# EAGLE design T3DPC_v0.2 (EAGLE 8.0.0)

## Sheet 1 of 4
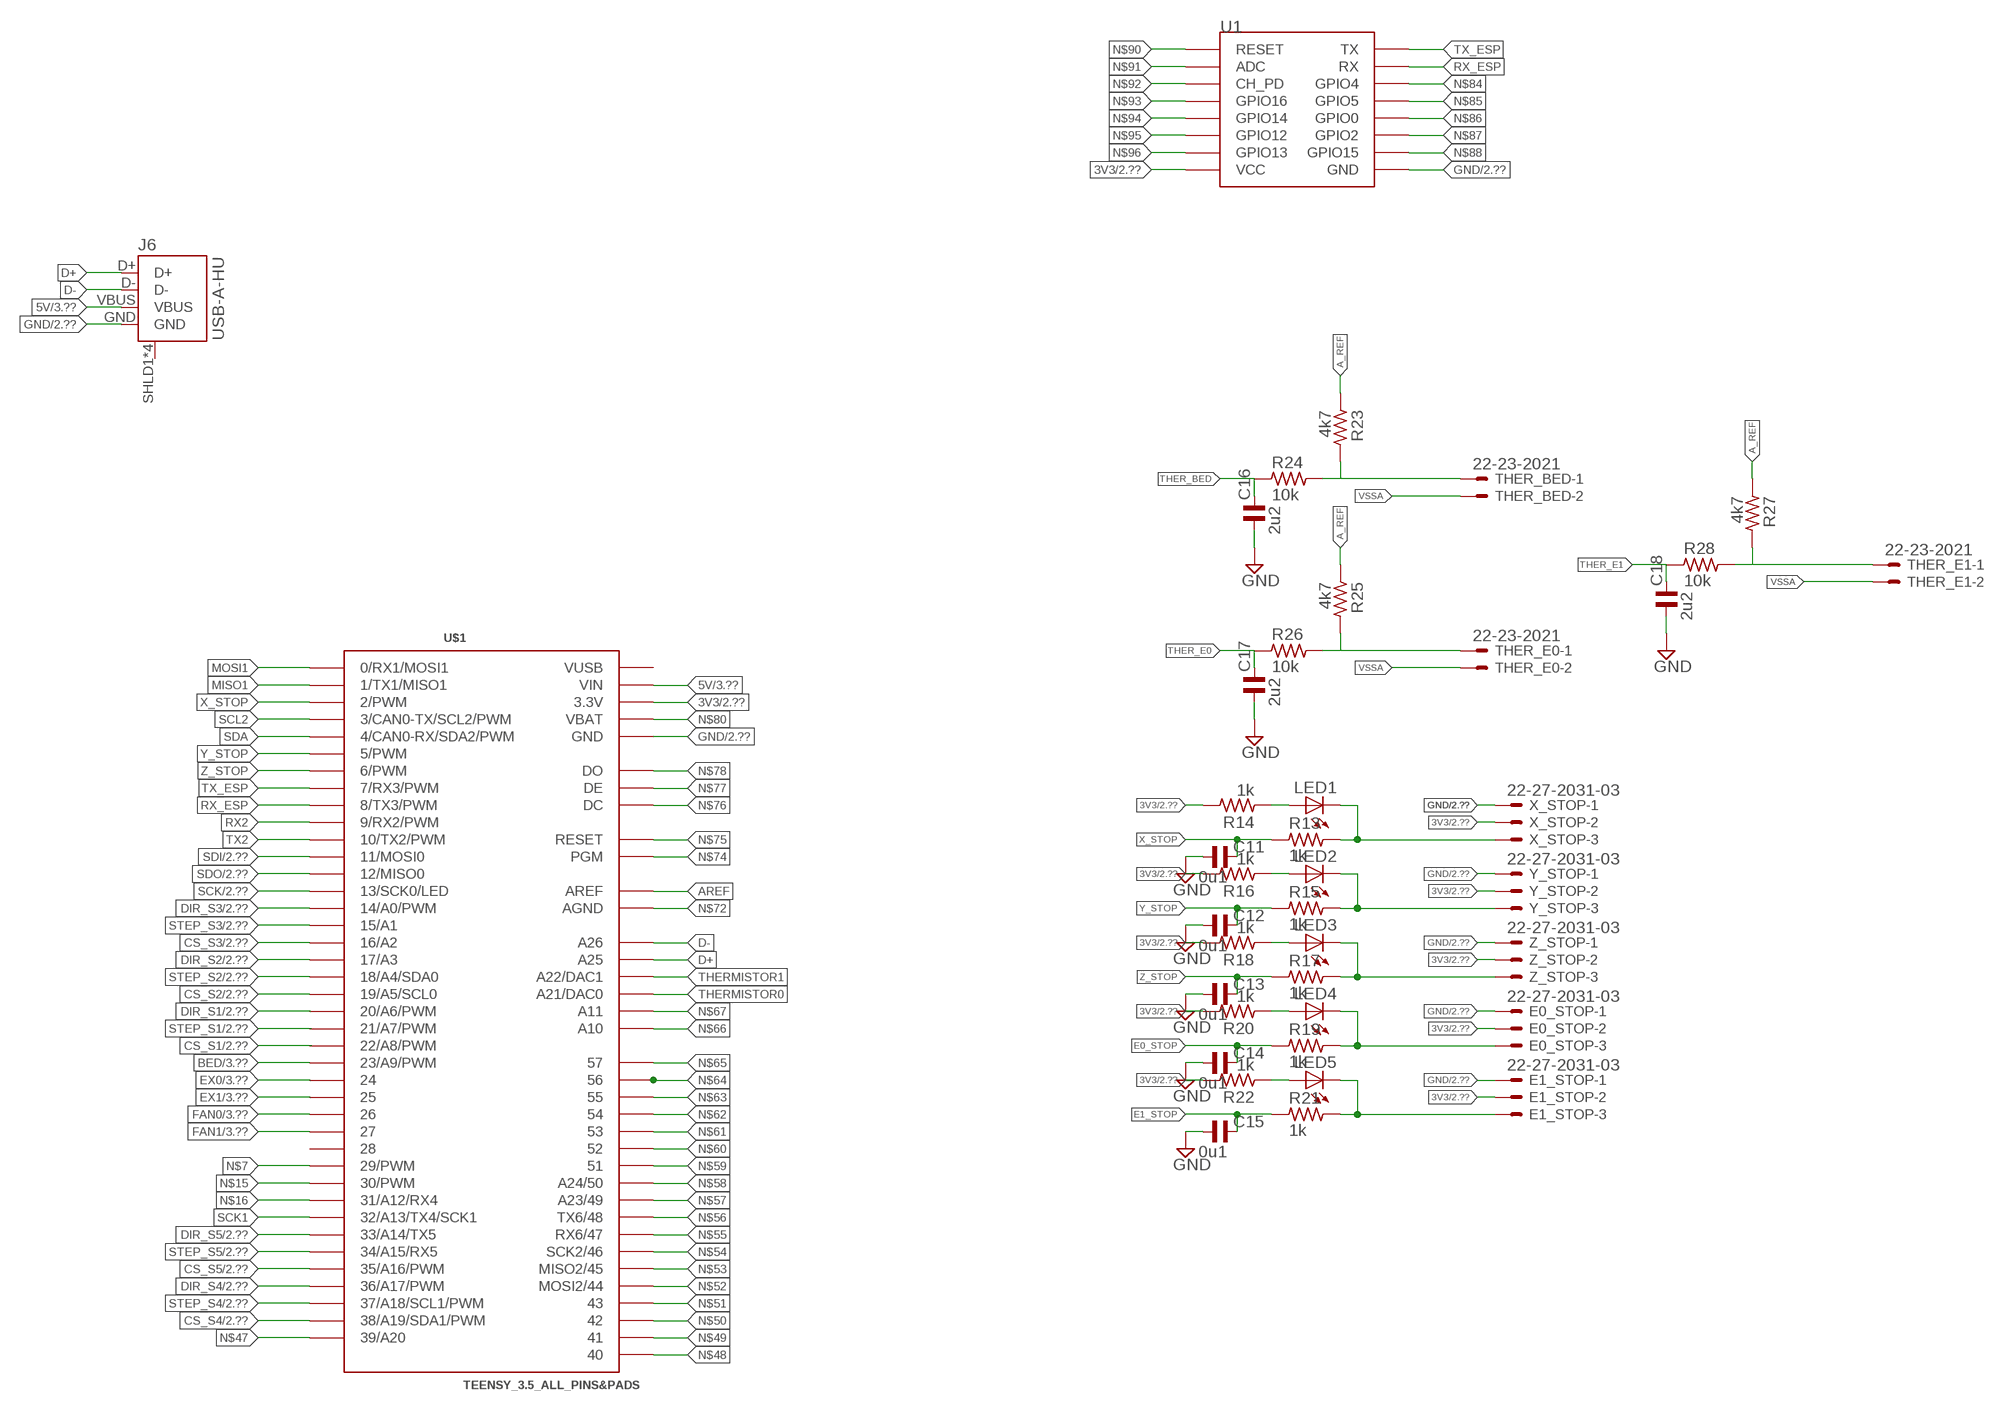
[diagram p0: schematic, sheet 1]

### Parts
C11  0u1  C_0805  [C0805]
C12  0u1  C_0805  [C0805]
C13  0u1  C_0805  [C0805]
C14  0u1  C_0805  [C0805]
C15  0u1  C_0805  [C0805]
C16  2u2  C_0805  [C0805]
C17  2u2  C_0805  [C0805]
C18  2u2  C_0805  [C0805]
E0_STOP  22-27-2031-03  [6410-03]
E1_STOP  22-27-2031-03  [6410-03]
J6  USB-A-HU  [USB-A-HU]
LED1  LEDCHIPLED_1206  [CHIPLED_1206]
LED2  LEDCHIPLED_1206  [CHIPLED_1206]
LED3  LEDCHIPLED_1206  [CHIPLED_1206]
LED4  LEDCHIPLED_1206  [CHIPLED_1206]
LED5  LEDCHIPLED_1206  [CHIPLED_1206]
R13  1k  R_0805  [R0805]
R14  1k  R_0805  [R0805]
R15  1k  R_0805  [R0805]
R16  1k  R_0805  [R0805]
R17  1k  R_0805  [R0805]
R18  1k  R_0805  [R0805]
R19  1k  R_0805  [R0805]
R20  1k  R_0805  [R0805]
R21  1k  R_0805  [R0805]
R22  1k  R_0805  [R0805]
R23  4k7  R_0805  [R0805]
R24  10k  R_0805  [R0805]
R25  4k7  R_0805  [R0805]
R26  10k  R_0805  [R0805]
R27  4k7  R_0805  [R0805]
R28  10k  R_0805  [R0805]
THER_BED  22-23-2021  [22-23-2021]
THER_E0  22-23-2021  [22-23-2021]
THER_E1  22-23-2021  [22-23-2021]
U1  ESP12SMD  [ESP12-SMD]
U$1  TEENSY_3.5_ALL_PINS&PADS  [TEENSY_3.5_ALL_PINS&PADS]
X_STOP  22-27-2031-03  [6410-03]
Y_STOP  22-27-2031-03  [6410-03]
Z_STOP  22-27-2031-03  [6410-03]

### Nets
3V3: E0_STOP.2 E1_STOP.2 R14.2 R16.2 R18.2 R20.2 R22.2 U1.VCC U$1.3.3V U$1.3.3V2(3.3V) U$1.3.3V3(3.3V) U$1.3.3V4(3.3V) X_STOP.2 Y_STOP.2 Z_STOP.2 ; also sheet 2,3
5V: J6.VBUS U$1.VIN ; also sheet 3,4
A_REF: R23.1 R25.1 R27.1
AREF: U$1.AREF
BED: U$1.23/A9(23/A9/PWM) ; also sheet 3
CS_S1: U$1.22/A8(22/A8/PWM) ; also sheet 2
CS_S2: U$1.19/A5(19/A5/SCL0) ; also sheet 2
CS_S3: U$1.16/A2 ; also sheet 2
CS_S4: U$1.38/A19(38/A19/SDA1/PWM) ; also sheet 2
CS_S5: U$1.35/A16(35/A16/PWM) ; also sheet 2
D+: J6.D+ U$1.A25
D-: J6.D- U$1.A26
DIR_S1: U$1.20/A6(20/A6/PWM) ; also sheet 2
DIR_S2: U$1.17/A3 ; also sheet 2
DIR_S3: U$1.14/A0(14/A0/PWM) ; also sheet 2
DIR_S4: U$1.36/A17(36/A17/PWM) ; also sheet 2
DIR_S5: U$1.33/A14(33/A14/TX5) ; also sheet 2
E0_STOP: C14.2 R19.1
E1_STOP: C15.2 R21.1
EX0: U$1.24 ; also sheet 3
EX1: U$1.25 ; also sheet 3
GND: C11.1 C12.1 C13.1 C14.1 C15.1 C16.1 C17.1 C18.1 E0_STOP.1 E1_STOP.1 J6.GND U1.GND U$1.GND U$1.GND1(GND) U$1.GND2(GND) U$1.GND3(GND) U$1.GND4(GND) U$1.GND5(GND) U$1.GND6(GND) X_STOP.1 Y_STOP.1 Z_STOP.1 ; also sheet 2,3,4
MISO1: U$1.1(1/TX1/MISO1)
MOSI1: U$1.0(0/RX1/MOSI1)
N$7: U$1.29(29/PWM)
N$10: LED1.A R14.1
N$13: LED2.A R16.1
N$14: LED3.A R18.1
N$15: U$1.30(30/PWM)
N$16: U$1.31/A12(31/A12/RX4)
N$17: LED4.A R20.1
N$18: LED5.A R22.1
N$19: R25.2 R26.2 THER_E0.1
N$20: R23.2 R24.2 THER_BED.1
N$22: R27.2 R28.2 THER_E1.1
N$47: U$1.39/A20
N$48: U$1.40
N$49: U$1.41
N$50: U$1.42
N$51: U$1.43
N$52: U$1.44(MOSI2/44)
N$53: U$1.45(MISO2/45)
N$54: U$1.46(SCK2/46)
N$55: U$1.47(RX6/47)
N$56: U$1.48(TX6/48)
N$57: U$1.49(A23/49)
N$58: U$1.50(A24/50)
N$59: U$1.51
N$60: U$1.52
N$61: U$1.53
N$62: U$1.54
N$63: U$1.55
N$64: U$1.56
N$65: U$1.57
N$66: U$1.A10
N$67: U$1.A11
N$72: U$1.AGND
N$74: U$1.PGM
N$75: U$1.RESET
N$76: U$1.DC
N$77: U$1.DE
N$78: U$1.DO
N$80: U$1.VBAT
N$84: U1.GPIO4
N$85: U1.GPIO5
N$86: U1.GPIO0
N$87: U1.GPIO2
N$88: U1.GPIO15
N$90: U1.RESET
N$91: U1.ADC
N$92: U1.CH_PD
N$93: U1.GPIO16
N$94: U1.GPIO14
N$95: U1.GPIO12
N$96: U1.GPIO13
RX2: U$1.9(9/RX2/PWM)
RX_ESP: U1.RXD0(RX) U$1.8(8/TX3/PWM)
SCK: U$1.13(13/SCK0/LED) ; also sheet 2
SCK1: U$1.32/A13(32/A13/TX4/SCK1)
SCL2: U$1.3(3/CAN0-TX/SCL2/PWM)
SDA: U$1.4(4/CAN0-RX/SDA2/PWM)
SDI: U$1.11(11/MOSI0) ; also sheet 2
SDO: U$1.12(12/MISO0) ; also sheet 2
STEP_S1: U$1.21/A7(21/A7/PWM) ; also sheet 2
STEP_S2: U$1.18/A4(18/A4/SDA0) ; also sheet 2
STEP_S3: U$1.15/A1 ; also sheet 2
STEP_S4: U$1.37/A18(37/A18/SCL1/PWM) ; also sheet 2
STEP_S5: U$1.34/A15(34/A15/RX5) ; also sheet 2
THER_BED: C16.2 R24.1
THER_E0: C17.2 R26.1
THER_E1: C18.2 R28.1
THERMISTOR0: U$1.A21(A21/DAC0)
THERMISTOR1: U$1.A22(A22/DAC1)
TX2: U$1.10(10/TX2/PWM)
TX_ESP: U1.TXD0(TX) U$1.7(7/RX3/PWM)
VSSA: THER_BED.2 THER_E0.2 THER_E1.2
X_STOP: C11.2 LED1.C LED2.C LED3.C LED4.C LED5.C R13.1 R13.2 R15.2 R17.2 R19.2 R21.2 U$1.2(2/PWM) X_STOP.3
Y_STOP: C12.2 R15.1 U$1.5(5/PWM)
Z_STOP: C13.2 R17.1 U$1.6(6/PWM)
Unconnected: E0_STOP.3 E1_STOP.3 J6.SHLD1(SHIELD) J6.SHLD2(SHIELD) J6.SHLD3(SHIELD) J6.SHLD4(SHIELD) U$1.26 U$1.27 U$1.28 Y_STOP.3 Z_STOP.3

## Sheet 2 of 4
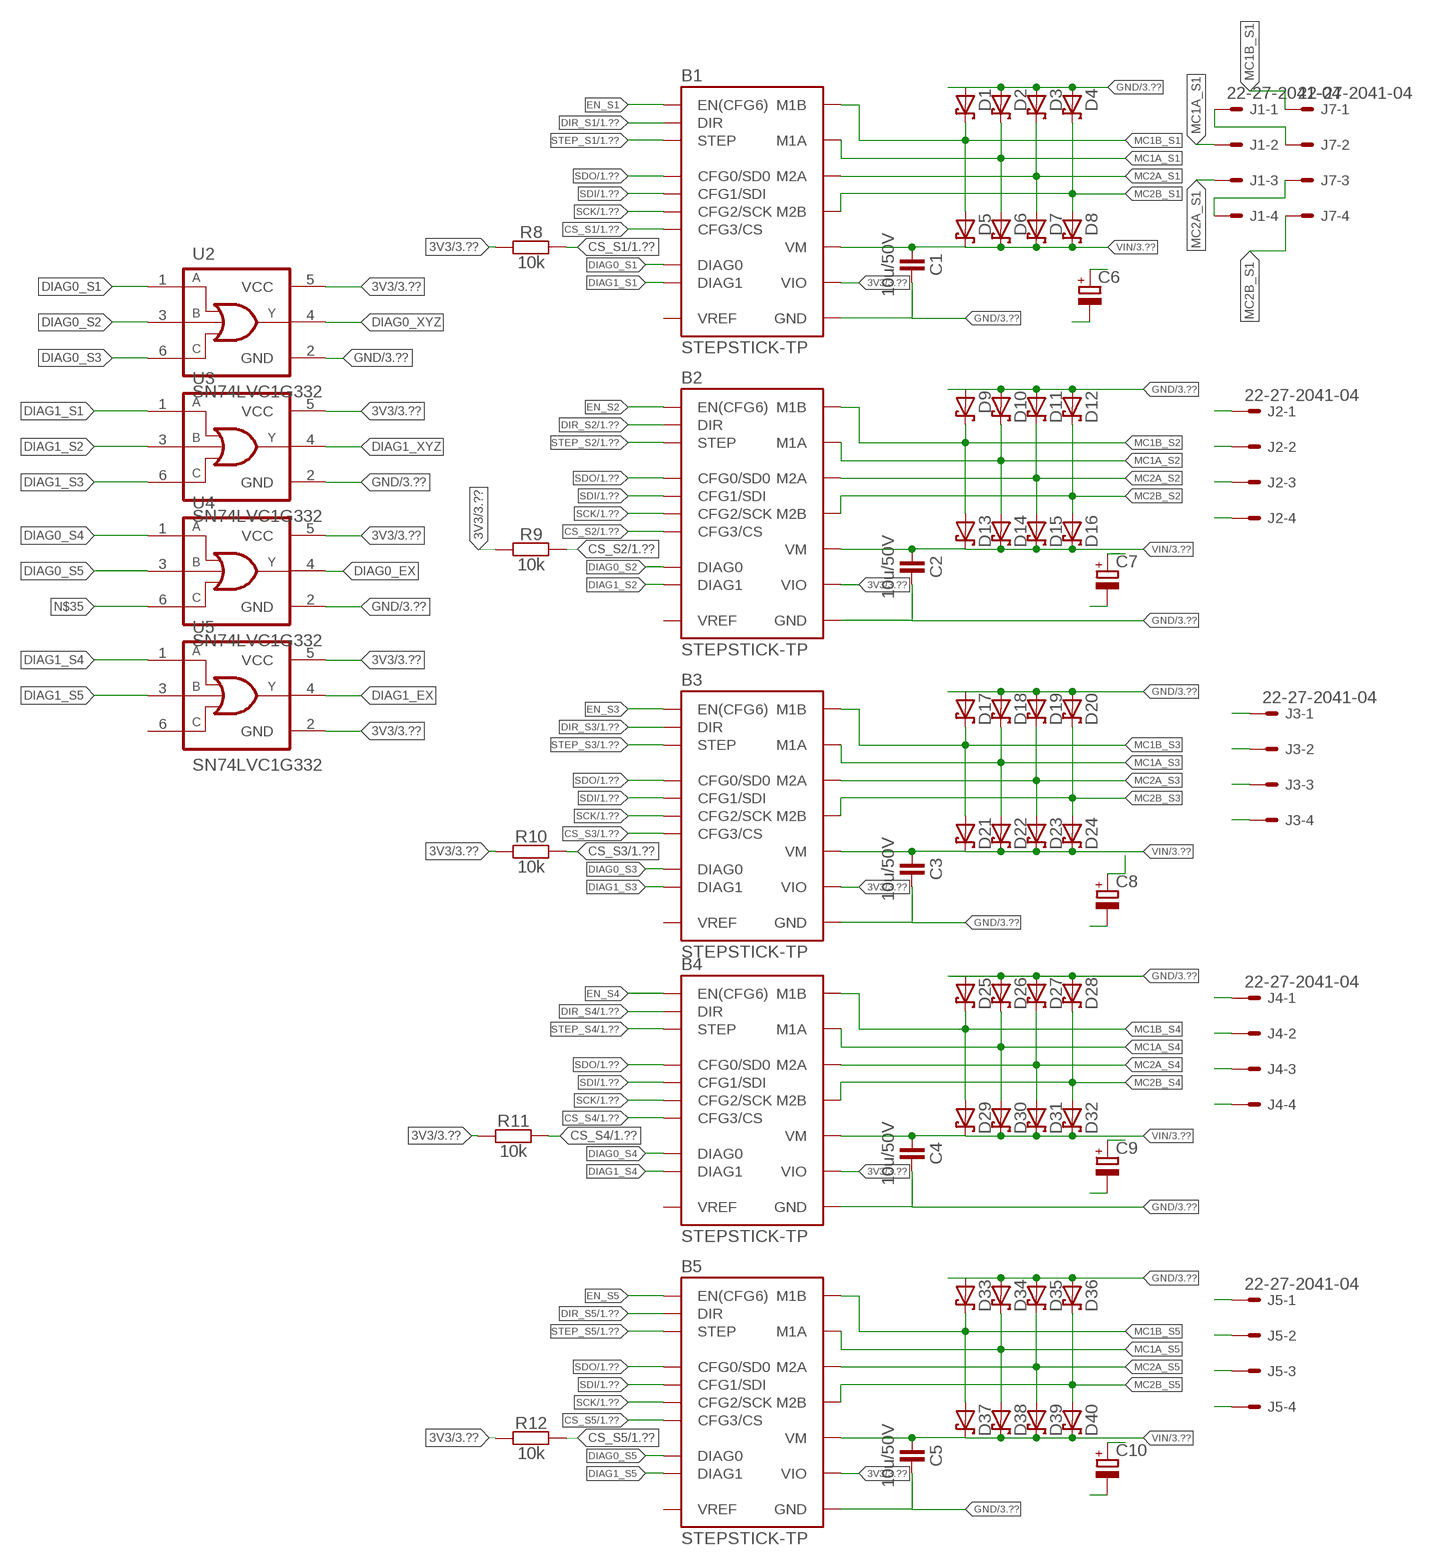
[diagram p1: schematic, sheet 2]

### Parts
B1  STEPSTICK-TP  [STEPSTICK_TP]
B2  STEPSTICK-TP  [STEPSTICK_TP]
B3  STEPSTICK-TP  [STEPSTICK_TP]
B4  STEPSTICK-TP  [STEPSTICK_TP]
B5  STEPSTICK-TP  [STEPSTICK_TP]
C1  10u/50V  CAPACITOR-1210  [C1210]
C2  10u/50V  CAPACITOR-1210  [C1210]
C3  10u/50V  CAPACITOR-1210  [C1210]
C4  10u/50V  CAPACITOR-1210  [C1210]
C5  10u/50V  CAPACITOR-1210  [C1210]
C6  CPOL-EU153CLV-0505  [153CLV-0505]
C7  CPOL-EU153CLV-0505  [153CLV-0505]
C8  CPOL-EU153CLV-0505  [153CLV-0505]
C9  CPOL-EU153CLV-0505  [153CLV-0505]
C10  CPOL-EU153CLV-0505  [153CLV-0505]
D1  D_SCHOTTKY-SMA  [SMA_DO214AC]
D2  D_SCHOTTKY-SMA  [SMA_DO214AC]
D3  D_SCHOTTKY-SMA  [SMA_DO214AC]
D4  D_SCHOTTKY-SMA  [SMA_DO214AC]
D5  D_SCHOTTKY-SMA  [SMA_DO214AC]
D6  D_SCHOTTKY-SMA  [SMA_DO214AC]
D7  D_SCHOTTKY-SMA  [SMA_DO214AC]
D8  D_SCHOTTKY-SMA  [SMA_DO214AC]
D9  D_SCHOTTKY-SMA  [SMA_DO214AC]
D10  D_SCHOTTKY-SMA  [SMA_DO214AC]
D11  D_SCHOTTKY-SMA  [SMA_DO214AC]
D12  D_SCHOTTKY-SMA  [SMA_DO214AC]
D13  D_SCHOTTKY-SMA  [SMA_DO214AC]
D14  D_SCHOTTKY-SMA  [SMA_DO214AC]
D15  D_SCHOTTKY-SMA  [SMA_DO214AC]
D16  D_SCHOTTKY-SMA  [SMA_DO214AC]
D17  D_SCHOTTKY-SMA  [SMA_DO214AC]
D18  D_SCHOTTKY-SMA  [SMA_DO214AC]
D19  D_SCHOTTKY-SMA  [SMA_DO214AC]
D20  D_SCHOTTKY-SMA  [SMA_DO214AC]
D21  D_SCHOTTKY-SMA  [SMA_DO214AC]
D22  D_SCHOTTKY-SMA  [SMA_DO214AC]
D23  D_SCHOTTKY-SMA  [SMA_DO214AC]
D24  D_SCHOTTKY-SMA  [SMA_DO214AC]
D25  D_SCHOTTKY-SMA  [SMA_DO214AC]
D26  D_SCHOTTKY-SMA  [SMA_DO214AC]
D27  D_SCHOTTKY-SMA  [SMA_DO214AC]
D28  D_SCHOTTKY-SMA  [SMA_DO214AC]
D29  D_SCHOTTKY-SMA  [SMA_DO214AC]
D30  D_SCHOTTKY-SMA  [SMA_DO214AC]
D31  D_SCHOTTKY-SMA  [SMA_DO214AC]
D32  D_SCHOTTKY-SMA  [SMA_DO214AC]
D33  D_SCHOTTKY-SMA  [SMA_DO214AC]
D34  D_SCHOTTKY-SMA  [SMA_DO214AC]
D35  D_SCHOTTKY-SMA  [SMA_DO214AC]
D36  D_SCHOTTKY-SMA  [SMA_DO214AC]
D37  D_SCHOTTKY-SMA  [SMA_DO214AC]
D38  D_SCHOTTKY-SMA  [SMA_DO214AC]
D39  D_SCHOTTKY-SMA  [SMA_DO214AC]
D40  D_SCHOTTKY-SMA  [SMA_DO214AC]
J1  22-27-2041-04  [6410-04]
J2  22-27-2041-04  [6410-04]
J3  22-27-2041-04  [6410-04]
J4  22-27-2041-04  [6410-04]
J5  22-27-2041-04  [6410-04]
J7  22-27-2041-04  [6410-04]
R8  10k  RESISTOR-0805  [C0805]
R9  10k  RESISTOR-0805  [C0805]
R10  10k  RESISTOR-0805  [C0805]
R11  10k  RESISTOR-0805  [C0805]
R12  10k  RESISTOR-0805  [C0805]
U2  SN74LVC1G332  [SC70-6]
U3  SN74LVC1G332  [SC70-6]
U4  SN74LVC1G332  [SC70-6]
U5  SN74LVC1G332  [SC70-6]

### Nets
3V3: B1.VIO B2.VIO B3.VIO B4.VIO B5.VIO R8.1 R9.1 R10.1 R11.1 R12.1 U2.5(VCC) U3.5(VCC) U4.5(VCC) U5.2(GND) U5.5(VCC) ; also sheet 1,3
CS_S1: B1.CFG3(CFG3/CS) R8.2 ; also sheet 1
CS_S2: B2.CFG3(CFG3/CS) R9.2 ; also sheet 1
CS_S3: B3.CFG3(CFG3/CS) R10.2 ; also sheet 1
CS_S4: B4.CFG3(CFG3/CS) R11.2 ; also sheet 1
CS_S5: B5.CFG3(CFG3/CS) R12.2 ; also sheet 1
DIAG0_EX: U4.4(Y)
DIAG0_S1: B1.DIAG0 U2.1(A)
DIAG0_S2: B2.DIAG0 U2.3(B)
DIAG0_S3: B3.DIAG0 U2.6(C)
DIAG0_S4: B4.DIAG0 U4.1(A)
DIAG0_S5: B5.DIAG0 U4.3(B)
DIAG0_XYZ: U2.4(Y)
DIAG1_EX: U5.4(Y)
DIAG1_S1: B1.DIAG1 U3.1(A)
DIAG1_S2: B2.DIAG1 U3.3(B)
DIAG1_S3: B3.DIAG1 U3.6(C)
DIAG1_S4: B4.DIAG1 U5.1(A)
DIAG1_S5: B5.DIAG1 U5.3(B)
DIAG1_XYZ: U3.4(Y)
DIR_S1: B1.DIR ; also sheet 1
DIR_S2: B2.DIR ; also sheet 1
DIR_S3: B3.DIR ; also sheet 1
DIR_S4: B4.DIR ; also sheet 1
DIR_S5: B5.DIR ; also sheet 1
EN_S1: B1.EN(EN(CFG6))
EN_S2: B2.EN(EN(CFG6))
EN_S3: B3.EN(EN(CFG6))
EN_S4: B4.EN(EN(CFG6))
EN_S5: B5.EN(EN(CFG6))
GND: B1.GND@1(GND) B1.GND@2(GND) B2.GND@1(GND) B2.GND@2(GND) B3.GND@1(GND) B3.GND@2(GND) B4.GND@1(GND) B4.GND@2(GND) B5.GND@1(GND) B5.GND@2(GND) C1.2 C2.2 C3.2 C4.2 C5.2 C6.- C7.- C8.- C9.- C10.- D1.A D2.A D3.A D4.A D9.A D10.A D11.A D12.A D17.A D18.A D19.A D20.A D25.A D26.A D27.A D28.A D33.A D34.A D35.A D36.A U2.2(GND) U3.2(GND) U4.2(GND) ; also sheet 1,3,4
MC1A_S1: B1.M1A D2.C D6.A J1.2
MC1A_S2: B2.M1A D10.C D14.A J2.2
MC1A_S3: B3.M1A D18.C D22.A J3.2
MC1A_S4: B4.M1A D26.C D30.A J4.2
MC1A_S5: B5.M1A D34.C D38.A J5.2
MC1B_S1: B1.M1B D1.C D5.A J7.1
MC1B_S2: B2.M1B D9.C D13.A J2.1
MC1B_S3: B3.M1B D17.C D21.A J3.1
MC1B_S4: B4.M1B D25.C D29.A J4.1
MC1B_S5: B5.M1B D33.C D37.A J5.1
MC2A_S1: B1.M2A D3.C D7.A J1.3
MC2A_S2: B2.M2A D11.C D15.A J2.3
MC2A_S3: B3.M2A D19.C D23.A J3.3
MC2A_S4: B4.M2A D27.C D31.A J4.3
MC2A_S5: B5.M2A D35.C D39.A J5.3
MC2B_S1: B1.M2B D4.C D8.A J7.4
MC2B_S2: B2.M2B D12.C D16.A J2.4
MC2B_S3: B3.M2B D20.C D24.A J3.4
MC2B_S4: B4.M2B D28.C D32.A J4.4
MC2B_S5: B5.M2B D36.C D40.A J5.4
N$11: J1.4 J7.3
N$12: J1.1 J7.2
N$35: U4.6(C)
SCK: B1.CFG2(CFG2/SCK) B2.CFG2(CFG2/SCK) B3.CFG2(CFG2/SCK) B4.CFG2(CFG2/SCK) B5.CFG2(CFG2/SCK) ; also sheet 1
SDI: B1.CFG1(CFG1/SDI) B2.CFG1(CFG1/SDI) B3.CFG1(CFG1/SDI) B4.CFG1(CFG1/SDI) B5.CFG1(CFG1/SDI) ; also sheet 1
SDO: B1.NC/CFG0(CFG0/SD0) B2.NC/CFG0(CFG0/SD0) B3.NC/CFG0(CFG0/SD0) B4.NC/CFG0(CFG0/SD0) B5.NC/CFG0(CFG0/SD0) ; also sheet 1
STEP_S1: B1.STEP ; also sheet 1
STEP_S2: B2.STEP ; also sheet 1
STEP_S3: B3.STEP ; also sheet 1
STEP_S4: B4.STEP ; also sheet 1
STEP_S5: B5.STEP ; also sheet 1
VIN: B1.VM B2.VM B3.VM B4.VM B5.VM C1.1 C2.1 C3.1 C4.1 C5.1 C6.+ C7.+ C8.+ C9.+ C10.+ D5.C D6.C D7.C D8.C D13.C D14.C D15.C D16.C D21.C D22.C D23.C D24.C D29.C D30.C D31.C D32.C D37.C D38.C D39.C D40.C ; also sheet 3,4
Unconnected: B1.VREF B2.VREF B3.VREF B4.VREF B5.VREF U5.6(C)

## Sheet 3 of 4
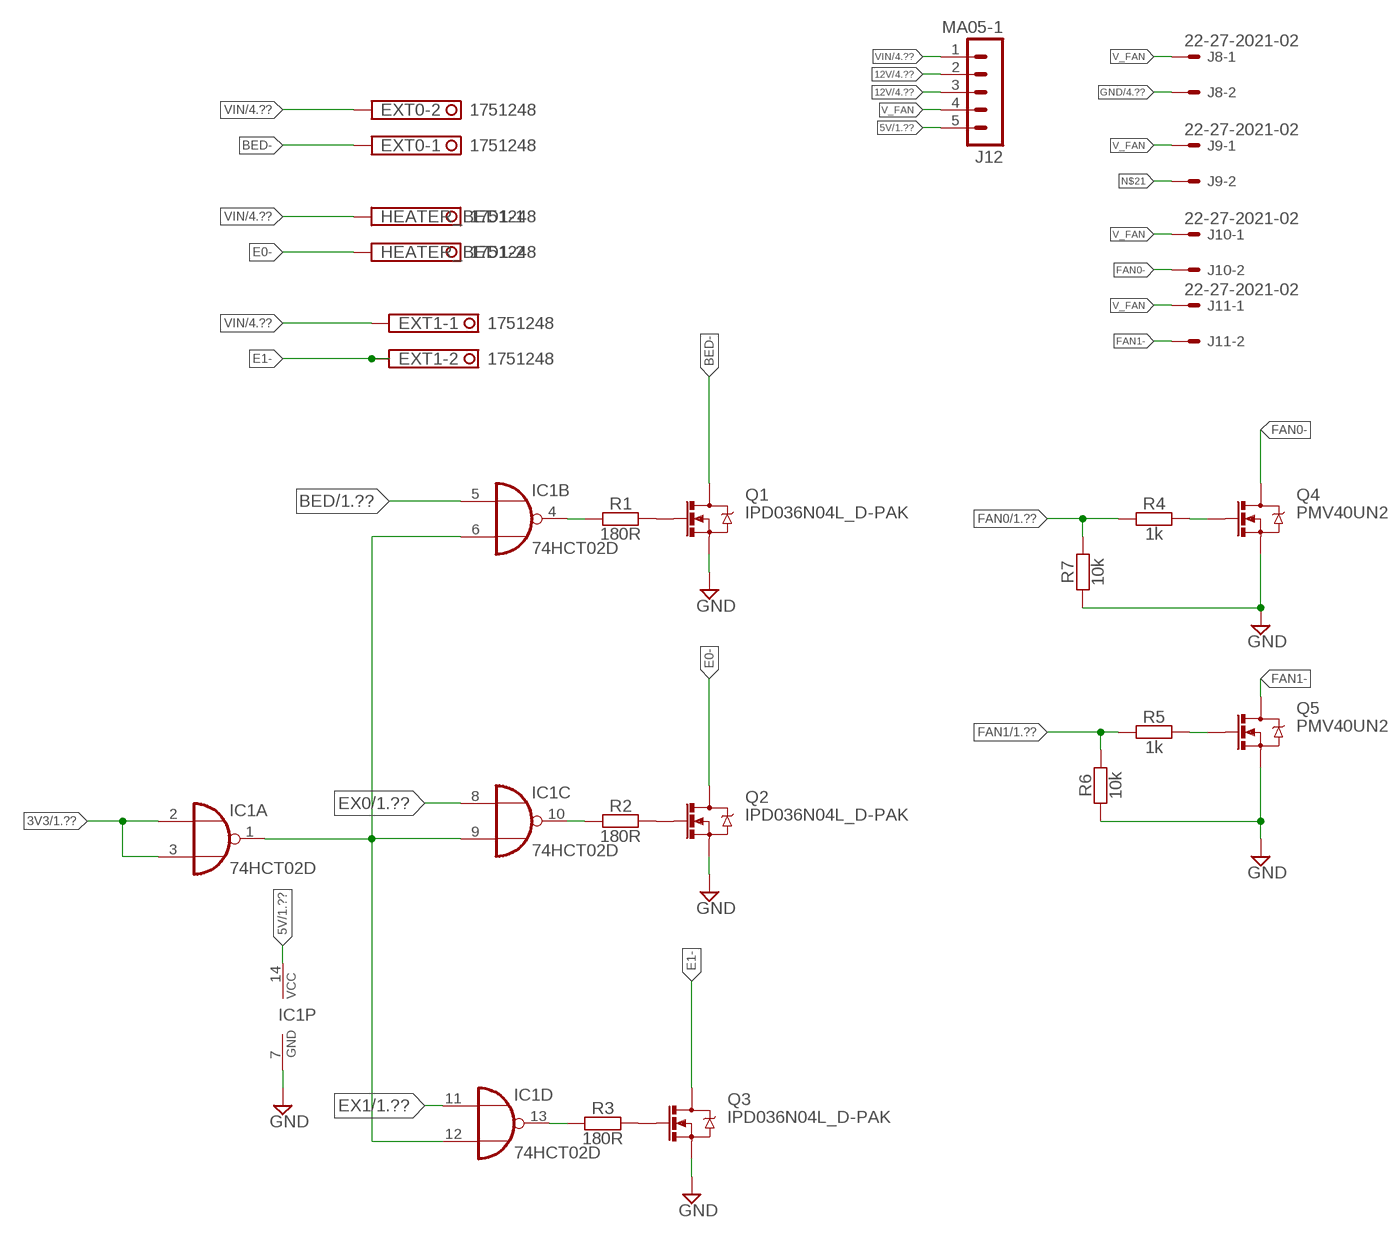
[diagram p2: schematic, sheet 3]

### Parts
EXT0  1751248  [1751248]
EXT1  1751248  [1751248]
HEATER_BED1  1751248  [1751248]
IC1  74HCT02D  [SO14]
J8  22-27-2021-02  [6410-02]
J9  22-27-2021-02  [6410-02]
J10  22-27-2021-02  [6410-02]
J11  22-27-2021-02  [6410-02]
J12  MA05-1  [MA05-1]
Q1  IPD036N04L_D-PAK  [D-PAK_TO252AA]
Q2  IPD036N04L_D-PAK  [D-PAK_TO252AA]
Q3  IPD036N04L_D-PAK  [D-PAK_TO252AA]
Q4  PMV40UN2  [SOT23-3]
Q5  PMV40UN2  [SOT23-3]
R1  180R  RESISTOR-0805  [C0805]
R2  180R  RESISTOR-0805  [C0805]
R3  180R  RESISTOR-0805  [C0805]
R4  1k  RESISTOR-0805  [C0805]
R5  1k  RESISTOR-0805  [C0805]
R6  10k  RESISTOR-0805  [C0805]
R7  10k  RESISTOR-0805  [C0805]

### Nets
3V3: IC1.2(A:I0) IC1.3(A:I1) ; also sheet 1,2
5V: IC1.14(P:VCC) J12.5 ; also sheet 1,4
12V: J12.2 J12.3 ; also sheet 4
BED: IC1.5(B:I0) ; also sheet 1
BED-: EXT0.1 Q1.2(D)
E0-: HEATER_BED1.2 Q2.2(D)
E1-: EXT1.2 Q3.2(D)
EX0: IC1.8(C:I0) ; also sheet 1
EX1: IC1.11(D:I0) ; also sheet 1
FAN0: R4.1 R7.2 ; also sheet 1
FAN0-: J10.2 Q4.3(D)
FAN1: R5.1 R6.2 ; also sheet 1
FAN1-: J11.2 Q5.3(D)
GND: IC1.7(P:GND) J8.2 Q1.3(S) Q2.3(S) Q3.3(S) Q4.2(S) Q5.2(S) R6.1 R7.1 ; also sheet 1,2,4
N$1: Q1.1(G) R1.2
N$2: Q2.1(G) R2.2
N$3: Q3.1(G) R3.2
N$4: IC1.4(B:O) R1.1
N$5: IC1.10(C:O) R2.1
N$6: IC1.13(D:O) R3.1
N$8: IC1.1(A:O) IC1.6(B:I1) IC1.9(C:I1) IC1.12(D:I1)
N$9: Q4.1(G) R4.2
N$21: J9.2
N$89: Q5.1(G) R5.2
V_FAN: J8.1 J9.1 J10.1 J11.1 J12.4
VIN: EXT0.2 EXT1.1 HEATER_BED1.1 J12.1 ; also sheet 2,4

## Sheet 4 of 4: Power
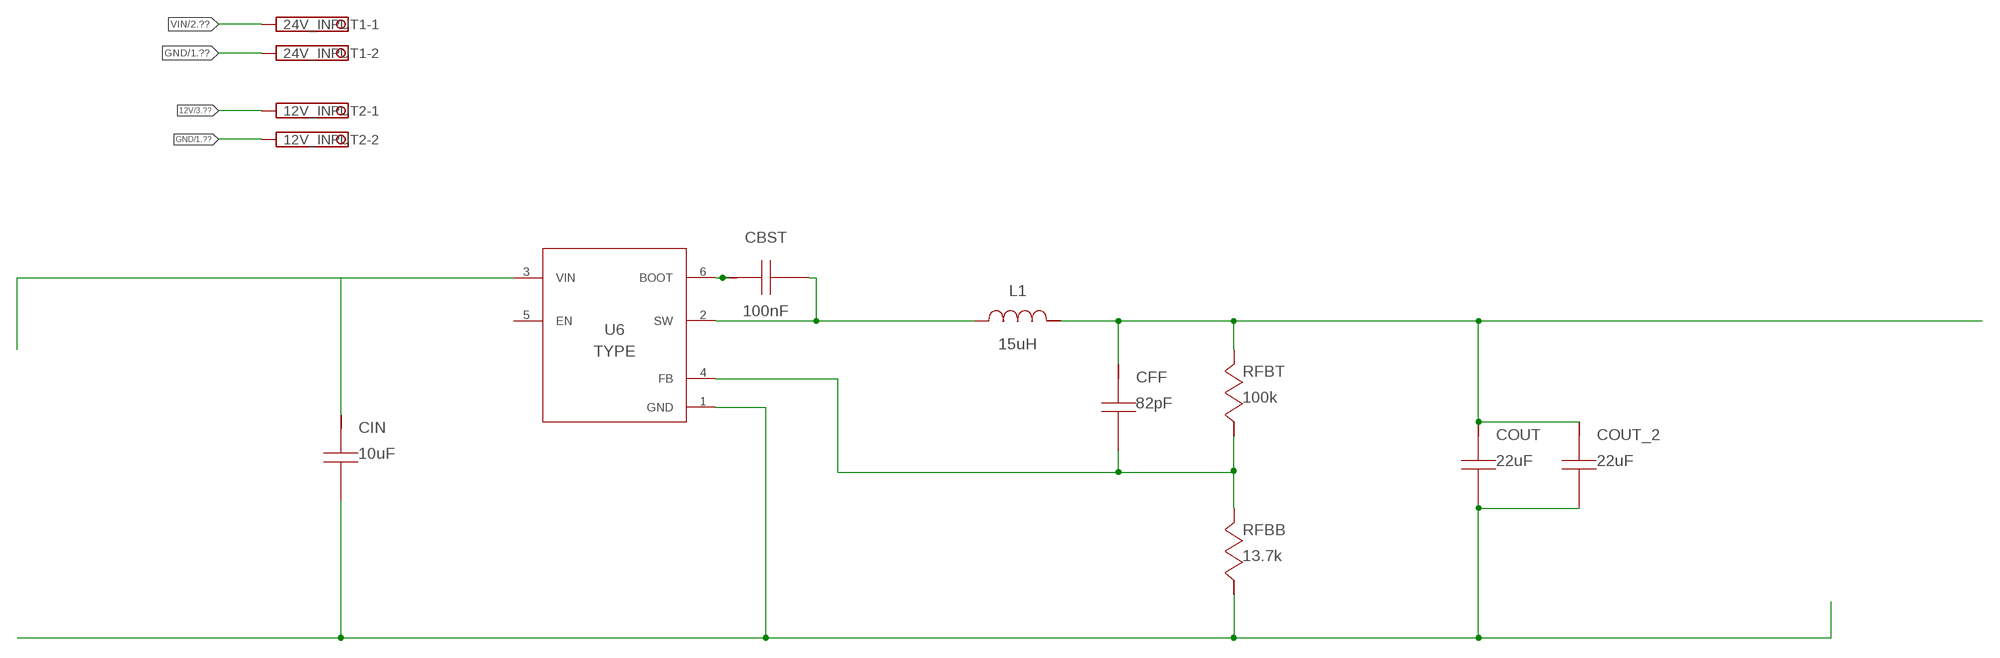
[diagram p3: schematic, sheet 4]

### Parts
12V_INPUT2  1751248  [1751248]
24V_INPUT1  1751248  [1751248]
CBST  100nF  C0805C104K5RACTU  [0805]
CFF  82pF  CC0805JRNPO9BN820  [0805]
CIN  10uF  C3216X5R1H106K160AB  [1206_180]
COUT  22uF  C4532X5R1E226M  [1812]
COUT_2  22uF  C4532X5R1E226M  [1812]
L1  15uH  VLP8040T-150M  [VLP8040]
RFBB  13.7k  ERJ-6ENF1372V  [0805]
RFBT  100k  ERJ-6ENF1003V  [0805]
U6  Value  TPS54202DDCR  [DDC0006A_N]

### Nets
1: CBST.1 U6.6(BOOT)
2: CFF.2 RFBB.1 RFBT.2 U6.4(FB)
3: CBST.2 L1.1 U6.2(SW)
5V: CFF.1 COUT.1 COUT_2.1 L1.2 RFBT.1 ; also sheet 1,3
12V: 12V_INPUT2.1 ; also sheet 3
GND: 12V_INPUT2.2 24V_INPUT1.2 CIN.2 COUT.2 COUT_2.2 RFBB.2 U6.1(GND) ; also sheet 1,2,3
VIN: 24V_INPUT1.1 CIN.1 U6.3(VIN) ; also sheet 2,3
Unconnected: U6.5(EN)

## Power pins joined to a net without a drawn wire
VUSB: U$1.VUSB

## Library data of the parts
12V_INPUT2 24V_INPUT1 EXT0 EXT1 HEATER_BED1 = con-phoenix-350:1751248: MKDS 1/ 2-3,5 Printklemme Nennstrom: 10 A Bemessungsspannung: 160 V Raster: 3,5 mm Polzahl: 2 Montageart: Löten Anschlussart: Schraubanschluss Anschlussrichtung vom Leiter zur Platine: 0° Source: http://eshop.phoenixcontact.com .. 1751248.pdf; OC_FARNELL: unknown; OC_NEWARK: unknown
B1-B5 = we-board:STEPSTICK: SilentStepStick - Trinamic TMC2100/TMC2130 Stepper Motor Driver TMC2100 - CFG pins for configuration TMC2130 - SPI for configuration Pin CFG0/SDO only available on TMC2130 SilentStepStick.
C1-C5 = we-rcl:CAPACITOR: Capacitors ...2.2uF @ 6.3V -> 0402 ...4.7uF @ 6.3V -> 0603 ...10uF @ 16V -> 0805 ...22uF @ 25V -> 1206
C6-C10 = rcl:CPOL-EU: POLARIZED CAPACITOR, European symbol
C11-C18 = rc-master-smd:C_: NON-POLARIZED CAP
CBST = AcceleratedDesigns_Lib:C0805C104K5RACTU; CAP: 1.0E7; ESR: 0.064; IRMS: 1.64; MANUFACTURER_NAME: Kemet; MANUFACTURER_PART_NUMBER: C0805C104K5RACTU; VDC: 50.0; VENDOR: Kemet
CFF = AcceleratedDesigns_Lib:CC0805JRNPO9BN820; CAP: 8.2E11; DATASHEETURL: httpwww.yageo.comdocumentsrecentUPY%2DGP%5FNP0%5F16V%2Dto%2D50V%5F10.pdf; ESR: 0.0; IRMS: 0.0; MANUFACTURER_NAME: Yageo America; MANUFACTURER_PART_NUMBER: CC0805JRNPO9BN820; VDC: 50.0; VENDOR: Yageo America
CIN = AcceleratedDesigns_Lib:C3216X5R1H106K160AB; CAP: 1.0E5; DATASHEETURL: httpsproduct.tdk.comensearchcapacitorceramicmlccinfo?part%5Fno%3DC3216X5R1H106K160AB; ESR: 0.002229; IRMS: 4.85932; MANUFACTURER_NAME: TDK; MANUFACTURER_PART_NUMBER: C3216X5R1H106K160AB; VDC: 50.0; VENDOR: TDK
COUT COUT_2 = AcceleratedDesigns_Lib:C4532X5R1E226M; CAP: 2.2E5; DATASHEETURL: httpwww.tdk.co.jptefe02e4855%5Fc.pdf; ESR: 0.002197; IRMS: 0.0; MANUFACTURER_NAME: TDK; MANUFACTURER_PART_NUMBER: C4532X5R1E226M; VDC: 25.0; VENDOR: TDK
D1-D40 = we-rcl:D_SCHOTTKY: Schottky Diodes
E0_STOP E1_STOP X_STOP Y_STOP Z_STOP = con-molex:22-?-03: CONNECTOR wire to board 2.54 mm (.1 inch) pitch header; OC_FARNELL: unknown; OC_NEWARK: unknown
IC1 = 74xx-eu:74*02: Quad 2-input NOR gate
J1-J5 J7 = con-molex:22-?-04: CONNECTOR wire to board 2.54 mm (.1 inch) pitch header; OC_FARNELL: unknown; OC_NEWARK: unknown
J6 = we-con:USB: USB Connectors
J8-J11 = con-molex:22-?-02: CONNECTOR wire to board 2.54 mm (.1 inch) pitch header; OC_FARNELL: unknown; OC_NEWARK: unknown
J12 = we-con:MA05-1: Pin Header
L1 = AcceleratedDesigns_Lib:VLP8040T-150M; DATASHEETURL: httpwww.tdk.co.jptjfx01j531_vlp.pdf; DCR: 0.058; DESCRIPTION: Unknown; IDC: 2.6; L: 1.5E5; MANUFACTURER: TDK; MANUFACTURER_NAME: TDK; MANUFACTURER_PART_NUMBER: VLP8040T150M; PACKAGE_DESIGNATOR: VLP8040; VENDOR: TDK
LED1-LED5 = led:LED: LED OSRAM: - CHIPLED LG R971, LG N971, LY N971, LG Q971, LY Q971, LO R971, LY R971 LH N974, LH R974 LS Q976, LO Q976, LY Q976 LO Q996 - Hyper CHIPLED LW Q18S LB Q993, LB Q99A, LB R99A - SideLED LS A670, LO A670, LY A670, LG A670, LP A670 LB A673, LV A673, LT A673, LW A673 LH A674 LY A675 LS A676, LA A676, LO A676, LY A676, LW A676 LS A679, LY A679, LG A679 - Hyper Micro SIDELED® LS Y876, LA Y876, LO Y876, LY Y876 LT Y87S - SmartLED LW L88C, LW L88S LB L89C, LB L89S, LG L890 LS L89K, LO L89K, LY L89K LS L896, LA L896, LO L896, LY L896 - TOPLED LS T670, LO T670, LY T670, LG T670, LP T670 LSG T670, LSP T670, LSY T670, LOP T670, LYG T670 LG T671, LOG T671, LSG T671 LB T673, LV T673, LT T673, LW T673 LH T674 LS T676, LA T676, LO T676, LY T676, LB T676, LH T676, LSB T676, LW T676 LB T67C, LV T67C, LT T67C, LS T67K, LO T67K, LY T67K, LW E67C LS E67B, LA E67B, LO E67B, LY E67B, LB E67C, LV E67C, LT E67C LW T67C LS T679, LY T679, LG T679 LS T770, LO T770, LY T770, LG T770, LP T770 LB T773, LV T773, LT T773, LW T773 LH T774 LS E675, LA E675, LY E675, LS T675 LS T776, LA T776, LO T776, LY T776, LB T776 LHGB T686 LT T68C, LB T68C - Hyper Mini TOPLED® LB M676 - Mini TOPLED Santana® LG M470 LS M47K, LO M47K, LY M47K Source: http://www.osram.convergy.de LUXEON: - LUMILED® LXK2-PW12-R00, LXK2-PW12-S00, LXK2-PW14-U00, LXK2-PW14-V00 LXK2-PM12-R00, LXK2-PM12-S00, LXK2-PM14-U00 LXK2-PE12-Q00, LXK2-PE12-R00, LXK2-PE12-S00, LXK2-PE14-T00, LXK2-PE14-U00 LXK2-PB12-K00, LXK2-PB12-L00, LXK2-PB12-M00, LXK2-PB14-N00, LXK2-PB14-P00, LXK2-PB14-Q00 LXK2-PR12-L00, LXK2-PR12-M00, LXK2-PR14-Q00, LXK2-PR14-R00 LXK2-PD12-Q00, LXK2-PD12-R00, LXK2-PD12-S00 LXK2-PH12-R00, LXK2-PH12-S00 LXK2-PL12-P00, LXK2-PL12-Q00, LXK2-PL12-R00 Source: www.luxeon.com KINGBRIGHT: KA-3528ASYC Source: www.kingbright.com
Q1-Q3 = infineon:IPD036N04L: Generic N-channel mosfet
Q4 Q5 = nxp:PMV40UN2
R1-R12 = we-rcl:RESISTOR: Resistors all kinds in 0402 and 0603
R13-R28 = rc-master-smd:R_: RESISTOR
RFBB = AcceleratedDesigns_Lib:ERJ-6ENF1372V; MANUFACTURER_NAME: Panasonic; MANUFACTURER_PART_NUMBER: ERJ6ENF1372V; POWER: 0.125; RESISTANCE: 13700.0; TOLERANCE: 1.0; VENDOR: Panasonic
RFBT = AcceleratedDesigns_Lib:ERJ-6ENF1003V; MANUFACTURER_NAME: Panasonic; MANUFACTURER_PART_NUMBER: ERJ6ENF1003V; POWER: 0.125; RESISTANCE: 100000.0; TOLERANCE: 1.0; VENDOR: Panasonic
THER_BED THER_E0 THER_E1 = con-molex:22-23-2021: .100" (2.54mm) Center Header - 2 Pin; MF: MOLEX; MPN: 22-23-2021; OC_FARNELL: 1462926; OC_NEWARK: 25C3832
U1 = esp8266modules:ESP12: ESP8266 Wifi module 12
U2-U5 = 74LV:SN74LVC1G332: OR GATE 3-INPUT
U6 = AcceleratedDesigns_Lib:TPS54202DDCR; ALTERNATEPARTNUMBER: TPS54202DDCT; APPLICATION_BUILDNUMBER: *; COMPTYPE: IC; MANUFACTURER: Texas Instruments; MANUFACTURER_NAME: Texas Instruments; MANUFACTURER_PART_NUMBER: TPS54202DDCR; MOUNTTYPE: SMT; PACKAGEREFERENCE: DDC0006A; PARTNUMBER: TPS54202DDCR; PIN_COUNT: 6; REFDES: RefDes; ROHS: Y; TYPE: TYPE
U$1 = Teensy_3_and_LC_Series_Boards_v1.4:TEENSY_3.5_ALL_PINS&PADS: All pins and pads on the Teensy 3.5 exposed. Assumes the use of multiple, unshrouded headers to get access to the pads on the underside of the Teensy These headers should be a 2x5, 2x4, and a 2x3 with a 0.1" hole spacing / pitch.

## Board
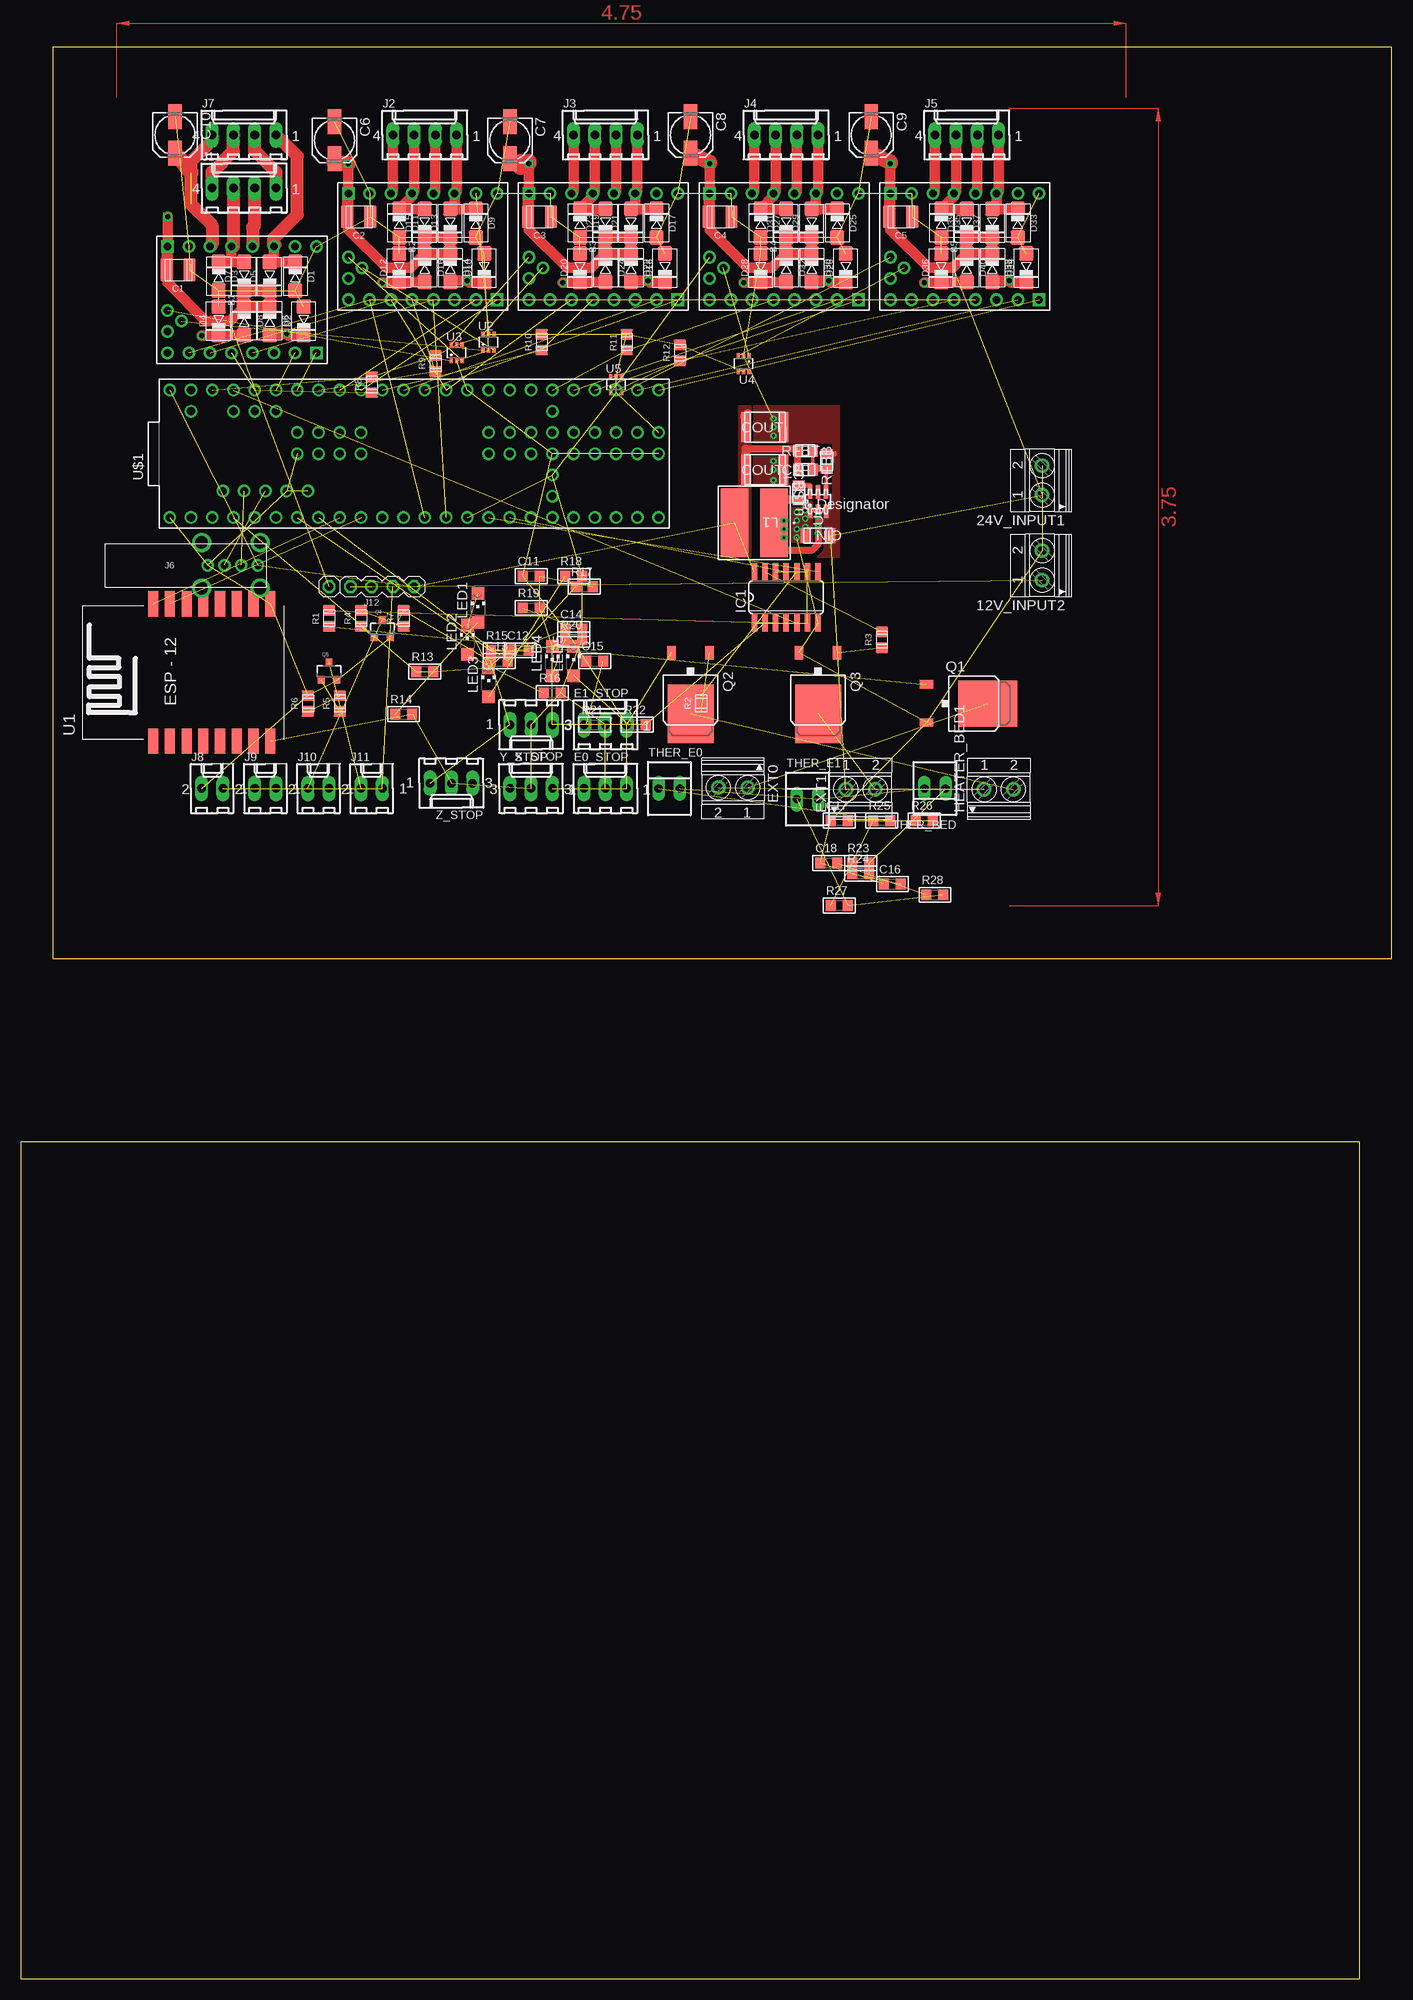
[diagram p4: board, top side]
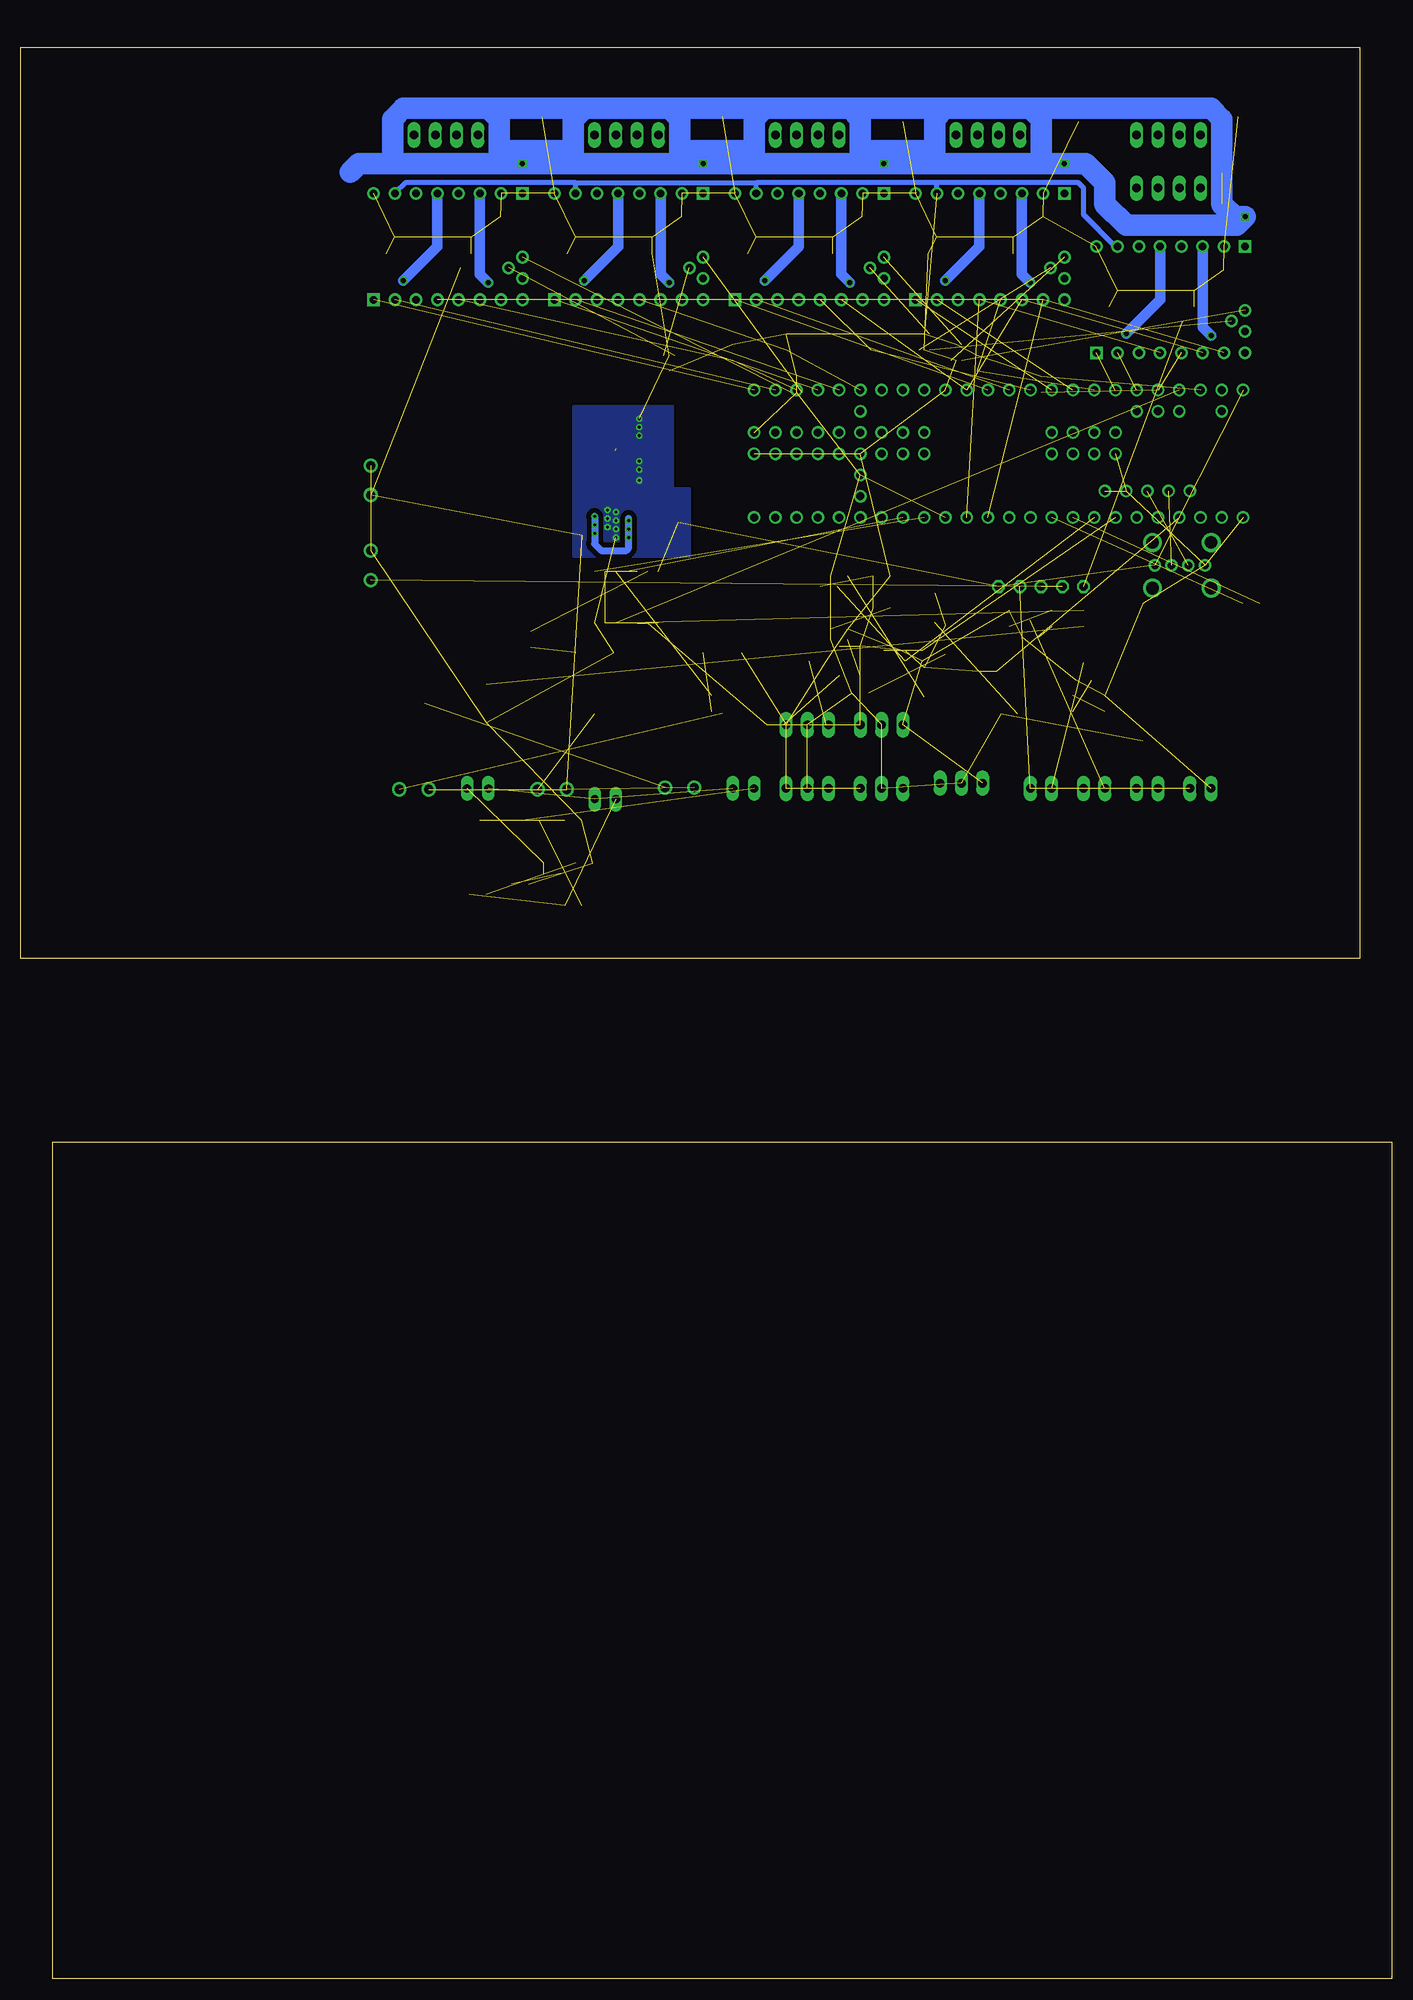
[diagram p5: board, bottom side, seen from below]

Size 163.81 x 230.81 mm. Coordinates in mm from the lower left corner, seen from the top.
Outline: 3.81,121.92 163.81,121.92 163.81,230.81 3.81,230.81 3.81,121.92
Outline: 0,0 160,0 160,100 0,100 0,0
Copper layers (1*16): Top 0.035mm / dielectric 1.5mm / Bottom 0.035mm
Design rules "default": minimum track width 10mil, minimum drill 24mil, track to track 8mil, track to pad 8mil, pad to pad 8mil, via to via 8mil, smd to smd 8mil, copper to edge 40mil, drill to drill 8mil, minimum pad ring 10mil, minimum via ring 8mil, stop-mask expansion 4mil, vias tented up to drill 0mil, thermal gap 10mil

### Footprints (pad centres in the part's own frame; a part is rotated, then mirrored left to right if it is on the bottom)
1751248 = drill 1.1 pad 1.7: 1 -1.75,-0.1; 2 1.75,-0.1
STEPSTICK_TP = drill 0.9 pad 1.5: CFG1 -6.35,6.35; CFG2 -6.35,3.81; CFG3 -6.35,1.27; DIAG0 -2.54,7.239; DIAG1 -1.27,8.89; EN -6.35,8.89; GND@1 6.35,6.35; GND@2 6.35,-8.89; M1A 6.35,-1.27; M1B 6.35,-3.81; M2A 6.35,1.27; M2B 6.35,3.81; NC -6.35,-3.81; NC/CFG0 -6.35,-1.27; STEP -6.35,-6.35; VIO 6.35,-6.35; VREF -3.81,8.89 | drill 0.9 pad 1.5 square: DIR -6.35,-8.89; VM 6.35,8.89
C1210 = smd 2.7 x 1.45: 1 0,1.4; 2 0,-1.35
153CLV-0505 = smd 3 x 1.6: + 2.2,0; - -2.2,0
C0805 = smd 1.2 x 1.3: 1 -1.016,0; 2 1.016,0
0805 = smd 1.118 x 1.448: 1 -0.902,0; 2 0.902,0
1206_180 = smd 1.118 x 1.803: 1 -1.499,0; 2 1.499,0
1812 = smd 1.067 x 3.607: 1 -2.273,0; 2 2.273,0
SMA_DO214AC = smd 1.7 x 1.7: A 0,-1.7; C 0,1.7
6410-03 = drill 1.016 long: 1 2.54,0; 2 0,0; 3 -2.54,0
SO14 = smd 0.66 x 2.032: 1 -3.81,-3.073; 2 -2.54,-3.073; 3 -1.27,-3.073; 4 0,-3.073; 5 1.27,-3.073; 6 2.54,-3.073; 7 3.81,-3.073; 8 3.81,3.073; 9 2.54,3.073; 10 1.27,3.073; 11 0,3.073; 12 -1.27,3.073; 13 -2.54,3.073; 14 -3.81,3.073
6410-04 = drill 1.016 long: 1 3.81,0; 2 1.27,0; 3 -1.27,0; 4 -3.81,0
USB-A-HU = drill 0.9 pad 1.45: D+ -2.73,0; D- -4.73,0; GND -0.73,0; VBUS -6.73,0 | drill 1.5: SHLD1 -7,2.72; SHLD2 -7,-2.72; SHLD3 0,-2.72; SHLD4 0,2.72
6410-02 = drill 1.016 long: 1 1.27,0; 2 -1.27,0
MA05-1 = drill 1 octagon: 1 0,5.08; 2 0,2.54; 3 0,0; 4 0,-2.54; 5 0,-5.08
VLP8040 = smd 3.302 x 8.204: 1 -2.349,0; 2 2.349,0
CHIPLED_1206 = smd 1.5 x 1.5: A 0,-1.75; C 0,1.75
D-PAK_TO252AA = smd 1 x 1.6: 1 -2.28,-4.8; 3 2.28,-4.8 | smd 5.5 x 7: 2 0,2.5
SOT23-3 = smd 0.8 x 0.9: 1 -0.95,-1; 2 0.95,-1; 3 0,1.1
C0805' = smd 1.5 x 1.25: 1 0,0.95; 2 0,-0.95
R0805 = smd 1.2 x 1.3: 1 -1.016,0; 2 1.016,0
22-23-2021 = drill 1 long: 1 -1.27,0; 2 1.27,0
ESP12-SMD = smd 3 x 1.2: ADC -8.3,3.8; CH_PD -8.3,1.8; GND 8.1,-8.2; GPIO0 8.1,-2.2; GPIO2 8.1,-4.2; GPIO4 8.1,1.8; GPIO5 8.1,-0.2; GPIO12 -8.3,-4.2; GPIO13 -8.3,-6.2; GPIO14 -8.3,-2.2; GPIO15 8.1,-6.2; GPIO16 -8.3,-0.2; RESET -8.3,5.8; RXD0 8.1,3.8; TXD0 8.1,5.8; VCC -8.3,-8.2
SC70-6 = smd 0.4 x 0.6: 1 -0.65,-0.95; 2 0,-0.95; 3 0.65,-0.95; 4 0.65,0.95; 5 0,0.95; 6 -0.65,0.95
DDC0006A_N = smd 1.575 x 0.559: 1 -1.168,0.95; 2 -1.168,0; 3 -1.168,-0.95; 4 1.168,-0.95; 5 1.168,0; 6 1.168,0.95
TEENSY_3.5_ALL_PINS&PADS = drill 0.965: 0 -7.62,13.97; 1 -7.62,11.43; 2 -7.62,8.89; 3 -7.62,6.35; 3.3V 7.62,11.43; 3.3V2 2.54,-41.91; 3.3V3 -7.62,-19.05; 3.3V4 -2.54,-29.21; 4 -7.62,3.81; 5 -7.62,1.27; 6 -7.62,-1.27; 7 -7.62,-3.81; 8 -7.62,-6.35; 9 -7.62,-8.89; 10 -7.62,-11.43; 11 -7.62,-13.97; 12 -7.62,-16.51; 13 7.62,-16.51; 14/A0 7.62,-13.97; 15/A1 7.62,-11.43; 16/A2 7.62,-8.89; 17/A3 7.62,-6.35; 18/A4 7.62,-3.81; 19/A5 7.62,-1.27; 20/A6 7.62,1.27; 21/A7 7.62,3.81; 22/A8 7.62,6.35; 23/A9 7.62,8.89; 24 -7.62,-21.59; 25 -7.62,-24.13; 26 -7.62,-26.67; 27 -7.62,-29.21; 28 -7.62,-31.75; 29 -7.62,-34.29; 30 -7.62,-36.83; 31/A12 -7.62,-39.37; 32/A13 -7.62,-41.91; 33/A14 7.62,-41.91; 34/A15 7.62,-39.37; 35/A16 7.62,-36.83; 36/A17 7.62,-34.29; 37/A18 7.62,-31.75; 38/A19 7.62,-29.21; 39/A20 7.62,-26.67; 40 0,-21.59; 41 0,-24.13; 42 0,-26.67; 43 0,-31.75; 44 0,-34.29; 45 0,-36.83; 46 0,-39.37; 47 2.54,-39.37; 48 2.54,-36.83; 49 2.54,-34.29; 50 2.54,-31.75; 51 2.54,-26.67; 52 2.54,-24.13; 53 2.54,-21.59; 54 2.54,-6.35; 55 2.54,-3.81; 56 2.54,-1.27; 57 2.54,1.27; A10 5.08,6.35; A11 5.08,3.81; A21 7.62,-24.13; A22 7.62,-21.59; A25 -4.445,5.08; A26 -4.445,7.62; AGND 7.62,13.97; AREF 5.08,8.89; DC 0,-3.81; DE 0,-1.27; DO 0,-6.35; GND -7.62,16.51; GND1 7.62,-19.05; GND2 0,1.27; GND3 -4.445,2.54; GND4 -4.445,0; GND5 0,-41.91; GND6 0,-29.21; NC -4.445,10.16; PGM 2.54,-29.21; RESET 5.08,-29.21; VBAT -5.08,-29.21; VIN 7.62,16.51; VUSB 5.08,13.97

### Placement (x,y rotation side)
12V_INPUT2  121.92,168.91 90 top
24V_INPUT1  121.92,179.07 90 top
B1  26.42,200.66 90 top
B2  48.01,207.01 90 top
B3  69.6,207.01 90 top
B4  91.19,207.01 90 top
B5  112.78,207.01 90 top
C1  18.8,204.22 90 top
C2  40.39,210.57 90 top
C3  61.98,210.57 90 top
C4  83.57,210.57 90 top
C5  105.16,210.57 90 top
C6  37.47,219.71 270 top
C7  58.42,219.71 270 top
C8  80.01,220.34 270 top
C9  101.6,220.34 270 top
C10  18.41,220.34 270 top
C11  60.96,167.64 0 top
C12  59.69,158.75 0 top
C13  57.15,157.48 0 top
C14  66.04,161.29 0 top
C15  68.58,157.48 0 top
C16  104.14,130.81 0 top
C17  97.79,138.43 0 top
C18  96.52,133.35 0 top
CBST  92.96,177.55 270 top
CFF  93.73,180.34 0 top
CIN  95.25,172.47 180 top
COUT  88.9,185.42 0 top
COUT_2  88.9,180.34 0 top
D1  32.77,203.45 0 top
D2  33.78,198.12 180 top
D3  23.62,203.45 0 top
D4  23.62,198.12 180 top
D5  29.72,203.45 180 top
D6  29.72,198.12 0 top
D7  26.67,203.45 180 top
D8  26.67,198.12 0 top
D9  54.36,209.8 0 top
D10  55.37,204.47 180 top
D11  45.21,209.8 0 top
D12  45.21,204.47 180 top
D13  51.31,209.8 180 top
D14  51.31,204.47 0 top
D15  48.26,209.8 180 top
D16  48.26,204.47 0 top
D17  75.95,209.8 0 top
D18  76.96,204.47 180 top
D19  66.8,209.8 0 top
D20  66.8,204.47 180 top
D21  72.9,209.8 180 top
D22  72.9,204.47 0 top
D23  69.85,209.8 180 top
D24  69.85,204.47 0 top
D25  97.54,209.8 0 top
D26  98.55,204.47 180 top
D27  88.39,209.8 0 top
D28  88.39,204.47 180 top
D29  94.49,209.8 180 top
D30  94.49,204.47 0 top
D31  91.44,209.8 180 top
D32  91.44,204.47 0 top
D33  119.13,209.8 0 top
D34  120.14,204.47 180 top
D35  109.98,209.8 0 top
D36  109.98,204.47 180 top
D37  116.08,209.8 180 top
D38  116.08,204.47 0 top
D39  113.03,209.8 180 top
D40  113.03,204.47 0 top
E0_STOP  69.85,142.24 0 top
E1_STOP  69.85,149.86 0 top
EXT0  85.09,142.24 180 top
EXT1  100.33,142.24 0 top
HEATER_BED1  116.84,142.24 0 top
IC1  91.44,165.1 0 top
J1  26.67,214 0 top
J2  48.26,220.34 0 top
J3  69.85,220.34 0 top
J4  91.44,220.34 0 top
J5  113.03,220.34 0 top
J6  21.59,168.91 180 top
J7  26.67,220.34 0 top
J8  22.86,142.24 0 top
J9  29.21,142.24 0 top
J10  35.56,142.24 0 top
J11  41.91,142.24 0 top
J12  41.91,166.37 90 top
L1  87.63,173.99 180 top
LED1  54.61,163.83 0 top
LED2  53.34,160.02 0 top
LED3  55.88,154.94 0 top
LED4  63.5,157.48 0 top
LED5  66.04,157.48 0 top
Q1  113.03,152.4 270 top
Q2  80.01,153.67 180 top
Q3  95.25,153.67 180 top
Q4  43.18,161.29 0 top
Q5  36.83,156.21 0 top
R1  180R  [C0805']  36.83,162.56 0 top
R2  180R  [C0805']  81.28,152.4 0 top
R3  180R  [C0805']  102.87,160.02 0 top
R4  1k  [C0805']  40.64,162.56 0 top
R5  1k  [C0805']  38.1,152.4 0 top
R6  10k  [C0805']  34.29,152.4 0 top
R7  10k  [C0805']  45.72,162.56 0 top
R8  10k  [C0805']  41.91,190.5 0 top
R9  10k  [C0805']  49.53,193.04 0 top
R10  10k  [C0805']  62.23,195.58 0 top
R11  10k  [C0805']  72.39,195.58 0 top
R12  10k  [C0805']  78.74,194.31 0 top
R13  48.26,156.21 0 top
R14  45.72,151.13 0 top
R15  57.15,158.75 0 top
R16  63.5,153.67 0 top
R17  67.31,166.37 0 top
R18  66.04,167.64 0 top
R19  60.96,163.83 0 top
R20  66.04,160.02 0 top
R21  68.58,149.86 0 top
R22  73.66,149.86 0 top
R23  100.33,133.35 0 top
R24  100.33,132.08 0 top
R25  102.87,138.43 0 top
R26  107.95,138.43 0 top
R27  97.79,128.27 0 top
R28  109.22,129.54 0 top
RFBB  96.27,181.36 90 top
RFBT  93.73,182.63 0 top
THER_BED  109.22,142.24 180 top
THER_E0  77.47,142.24 0 top
THER_E1  93.98,140.97 0 top
U1  21.59,156.21 90 top
U2  55.88,195.58 0 top
U3  52.07,194.31 0 top
U4  86.36,193.04 180 top
U5  71.12,190.5 0 top
U6  95.25,176.53 90 top
U$1  34.29,182.25 90 top
X_STOP  60.96,149.86 180 top
Y_STOP  60.96,142.24 0 top
Z_STOP  51.44,142.88 180 top

### Tracks (layer width: path | path; a pad name or v marks a point on that pad's centre or on a via)
1
  Top 0.61: U6.6 94.3,178.45 CBST.1
2
  Top 0.406: U6.4 96.2,180.45 | RFBT.2 CFF.2
  Top 0.813: CFF.2 94.63,180.45 RFBB.1 96.2,180.45
3  (via drill 0.33)
  Top 0.813: 90.17,174.18 90.17,172.09 91.57,170.69 94.49,170.69 95.25,171.45 v95.25,172.72 v95.25,173.74 v95.25,174.75 U6.2 | 90.17,174.18 90.17,175.26 91.05,176.14 | 90.17,174.18 L1.1
  Top 1.016: CBST.2 92.96,176.78 89.98,176.78 L1.1
  Bottom 0.813: v95.25,174.75 95.25,171.45 94.49,170.69 91.44,170.69 91.19,170.94 v91.19,172.21 v91.19,173.23 v91.19,174.24 91.19,174.5
3V3  (27 unrouted)
  Bottom 0.61: 54.36,214.63 75.95,214.63 | 97.54,214.63 75.95,214.63 | 97.54,214.63 117.86,214.63 B5.VIO | B3.VIO 75.95,214.63 | B4.VIO 97.54,214.63 | B2.VIO 54.36,214.63 | B1.VIO 33.02,207.01 36.83,210.82 36.83,214 37.47,214.63 54.36,214.63
5V  (5 unrouted)
  Top 0.813: 86.87,187.2 86.36,186.69 | 86.63,182.88 92.71,182.88 | CFF.1 RFBT.1
  Top 1.016: COUT_2.1 86.63,182.88
  pour Top (no thermals): 87.12,169.93 83.82,169.93 83.82,178.05 85.85,178.05 85.85,187.96 87.12,187.96
12V  (2 unrouted)
A_REF  (2 unrouted)
BED  (1 unrouted)
BED-  (1 unrouted)
CS_S1  (2 unrouted)
CS_S2  (2 unrouted)
CS_S3  (2 unrouted)
CS_S4  (2 unrouted)
CS_S5  (2 unrouted)
D+  (1 unrouted)
D-  (1 unrouted)
DIAG0_S1  (1 unrouted)
DIAG0_S2  (1 unrouted)
DIAG0_S3  (1 unrouted)
DIAG0_S4  (1 unrouted)
DIAG0_S5  (1 unrouted)
DIAG1_S1  (1 unrouted)
DIAG1_S2  (1 unrouted)
DIAG1_S3  (1 unrouted)
DIAG1_S4  (1 unrouted)
DIAG1_S5  (1 unrouted)
DIR_S1  (1 unrouted)
DIR_S2  (1 unrouted)
DIR_S3  (1 unrouted)
DIR_S4  (1 unrouted)
DIR_S5  (1 unrouted)
E0-  (1 unrouted)
E0_STOP  (1 unrouted)
E1-  (1 unrouted)
E1_STOP  (1 unrouted)
EX0  (1 unrouted)
EX1  (1 unrouted)
FAN0  (1 unrouted)
FAN0-  (1 unrouted)
FAN1  (1 unrouted)
FAN1-  (1 unrouted)
GND  (via drill 0.33, 0.33 pad 0.33)  (76 unrouted)
  Top 0.406: RFBB.2 96.27,182.12 97.28,182.12 97.28,182.37
  other vias: 92.71,172.21 92.71,173.23 92.71,174.24 92.71,175.26 93.73,173.48 93.73,174.5 93.73,175.51 89.92,179.07 89.92,180.34 89.92,181.36 89.92,184.4 89.92,185.42 89.92,186.44
  pour Top (no thermals): 94.49,176.53 94.49,171.7 92.2,171.7 92.2,177.04 93.73,177.04 93.73,176.53
  pour Bottom (isolate 0.61, no thermals): 97.79,169.93 83.82,169.93 83.82,178.05 85.85,178.05 85.85,187.96 97.79,187.96
  pour Top (no thermals): 87.63,187.96 87.63,183.64 97.03,183.64 97.03,176.53 97.79,176.53 97.79,187.96
  pour Top (no thermals): 91.44,181.86 91.44,178.56 87.63,178.56 87.63,181.86
MC1A_S1  (via drill 0.6 pad 0.33)
  Top 1.27: D6.A 29.89,196.6 v31.75,196.6 32,196.34 33.78,196.34 D2.C
  Top 1.524: J1.2 27.94,209.55 27.69,209.3 B1.M1A
  Bottom 1.27: B1.M1A 27.69,200.66 v31.75,196.6
MC1A_S2  (via drill 0.6 pad 0.33)
  Top 1.27: D14.A 51.48,202.95 v53.34,202.95 53.59,202.69 55.37,202.69 D10.C | J2.2 49.53,213.61 B2.M1A
  Bottom 1.27: B2.M1A 49.28,207.01 v53.34,202.95
MC1A_S3  (via drill 0.6 pad 0.33)
  Top 1.27: D22.A 73.07,202.95 v74.93,202.95 75.18,202.69 76.96,202.69 D18.C | J3.2 71.12,213.61 B3.M1A
  Bottom 1.27: B3.M1A 70.87,207.01 v74.93,202.95
MC1A_S4  (via drill 0.6 pad 0.33)
  Top 1.27: D30.A 94.66,202.95 v96.52,202.95 96.77,202.69 98.55,202.69 D26.C | J4.2 92.71,213.61 B4.M1A
  Bottom 1.27: B4.M1A 92.46,207.01 v96.52,202.95
MC1A_S5  (via drill 0.6 pad 0.33)
  Top 1.27: D38.A 116.25,202.95 v118.11,202.95 118.36,202.69 120.14,202.69 D34.C | J5.2 114.3,213.61 B5.M1A
  Bottom 1.27: B5.M1A 114.05,207.01 v118.11,202.95
MC1B_S1
  Top 1.27: 30.48,205.15 D5.A | 30.48,205.15 D1.C | 30.48,207.26 B1.M1B 30.23,205.41 30.48,205.15
  Top 1.524: B1.M1B 30.23,208.03 33.02,210.82 33.02,217.81 J7.1
MC1B_S2
  Top 1.27: D9.C D13.A 51.82,212.01 B2.M1B 52.07,213.61 J2.1
MC1B_S3
  Top 1.27: D17.C D21.A 73.41,212.01 B3.M1B 73.66,213.61 J3.1
MC1B_S4
  Top 1.27: D25.C D29.A 95,212.01 B4.M1B 95.25,213.61 J4.1
MC1B_S5
  Top 1.27: D33.C D37.A 116.59,212.01 B5.M1B 116.84,213.61 J5.1
MC2A_S1
  Top 1.27: 25.4,205.15 D3.C | 25.4,205.15 D7.A | B1.M2A 25.15,205.41 25.4,205.15
  Top 1.524: J1.3 25.4,207.01 B1.M2A
MC2A_S2
  Top 1.27: D15.A D11.C 46.74,213.03 B2.M2A 46.99,213.61 J2.3
MC2A_S3
  Top 1.27: D23.A D19.C 68.33,213.03 B3.M2A 68.58,213.61 J3.3
MC2A_S4
  Top 1.27: D31.A D27.C 89.92,213.03 B4.M2A 90.17,213.61 J4.3
MC2A_S5
  Top 1.27: D39.A D35.C 111.51,213.03 B5.M2A 111.76,213.61 J5.3
MC2B_S1  (via drill 0.6 pad 0.33)
  Top 1.27: v21.59,196.34 23.54,196.34 D4.C D8.A | B1.M2B 22.86,207.26
  Top 1.524: J7.4 22.86,219.71 20.32,217.17 20.32,212.09 22.86,209.55 22.86,207.26 B1.M2B
  Bottom 1.27: B1.M2B 22.61,197.36 v21.59,196.34
MC2B_S2  (via drill 0.6 pad 0.33)
  Top 1.27: v43.18,202.69 45.13,202.69 D12.C D16.A | J2.4 44.45,213.61 B2.M2B
  Bottom 1.27: B2.M2B 44.2,203.71 v43.18,202.69
MC2B_S3  (via drill 0.6 pad 0.33)
  Top 1.27: v64.77,202.69 66.72,202.69 D20.C D24.A | J3.4 66.04,213.61 B3.M2B
  Bottom 1.27: B3.M2B 65.79,203.71 v64.77,202.69
MC2B_S4  (via drill 0.6 pad 0.33)
  Top 1.27: v86.36,202.69 88.31,202.69 D28.C D32.A | J4.4 87.63,213.61 B4.M2B
  Bottom 1.27: B4.M2B 87.38,203.71 v86.36,202.69
MC2B_S5  (via drill 0.6 pad 0.33)
  Top 1.27: v107.95,202.69 109.9,202.69 D36.C D40.A | J5.4 109.22,213.61 B5.M2B
  Bottom 1.27: B5.M2B 108.97,203.71 v107.95,202.69
N$1  (1 unrouted)
N$2  (1 unrouted)
N$3  (1 unrouted)
N$4  (1 unrouted)
N$5  (1 unrouted)
N$6  (1 unrouted)
N$8  (3 unrouted)
N$9  (1 unrouted)
N$10  (1 unrouted)
N$11
  Top 1.524: J1.4 22.86,215.9 25.4,218.44 J7.3
N$12
  Top 1.524: J1.1 30.48,215.9 27.94,218.44 J7.2
N$13  (1 unrouted)
N$14  (1 unrouted)
N$17  (1 unrouted)
N$18  (1 unrouted)
N$19  (2 unrouted)
N$20  (2 unrouted)
N$22  (2 unrouted)
N$89  (1 unrouted)
RX_ESP  (1 unrouted)
SCK  (5 unrouted)
SDI  (5 unrouted)
SDO  (5 unrouted)
STEP_S1  (1 unrouted)
STEP_S2  (1 unrouted)
STEP_S3  (1 unrouted)
STEP_S4  (1 unrouted)
STEP_S5  (1 unrouted)
THER_BED  (1 unrouted)
THER_E0  (1 unrouted)
THER_E1  (1 unrouted)
TX_ESP  (1 unrouted)
V_FAN  (4 unrouted)
VIN  (via drill 0.6)  (7 unrouted)
  Top 1.016: D7.C D5.C | D15.C D13.C | D23.C D21.C | D31.C D29.C | D39.C D37.C
  Top 1.27: C1.1 17.4,207.14 B1.VM | B1.VM 17.53,202.69 22.1,198.12 24.97,198.12 D8.C 26.67,199.9 | 26.67,199.9 D7.C | 26.92,199.9 26.42,200.41 26.42,201.42 26.75,201.75 D5.C 29.72,199.9 | 26.67,199.9 D6.C 29.72,199.9 | 29.72,199.9 26.42,199.9 | C2.1 38.99,213.49 B2.VM | B2.VM 39.12,209.04 43.69,204.47 46.56,204.47 D16.C 48.26,206.25 | 48.26,206.25 D15.C | 48.51,206.25 48.01,206.76 48.01,207.77 48.34,208.1 D13.C 51.31,206.25 | 48.26,206.25 D14.C 51.31,206.25 | 51.31,206.25 48.01,206.25 | C3.1 60.58,213.49 B3.VM | B3.VM 60.71,209.04 65.28,204.47 68.15,204.47 D24.C 69.85,206.25 | 69.85,206.25 D23.C | 70.1,206.25 69.6,206.76 69.6,207.77 69.93,208.1 D21.C 72.9,206.25 | 69.85,206.25 D22.C 72.9,206.25 | 72.9,206.25 69.6,206.25 | C4.1 82.17,213.49 B4.VM | B4.VM 82.3,209.04 86.87,204.47 89.74,204.47 D32.C 91.44,206.25 | 91.44,206.25 D31.C | 91.69,206.25 91.19,206.76 91.19,207.77 91.52,208.1 D29.C 94.49,206.25 | 91.44,206.25 D30.C 94.49,206.25 | 94.49,206.25 91.19,206.25 | C5.1 103.76,213.49 B5.VM | B5.VM 103.89,209.04 108.46,204.47 111.33,204.47 D40.C 113.03,206.25 | 113.03,206.25 D39.C | 113.28,206.25 112.78,206.76 112.78,207.77 113.11,208.1 D37.C 116.08,206.25 | 113.03,206.25 D38.C 116.08,206.25 | 116.08,206.25 112.78,206.25 | v103.89,216.92 B5.VM | v82.3,216.92 B4.VM | v60.71,216.92 B3.VM | B2.VM v39.12,216.92 | B1.VM v17.53,210.57
  Top 1.778: C7.+ 59.69,216.46 59.69,217.17 60.71,217.17 v60.71,216.92 | C8.+ 82.3,217.09 v82.3,216.92 | C9.+ 103.89,217.09 v103.89,216.92 | C10.+ 20.32,215.82 20.32,215.9 | v39.12,216.92 37.47,216.92 C6.+
  Bottom 2.54: 119.38,216.92 v103.89,216.92 v82.3,216.92 v60.71,216.92 v39.12,216.92 36.58,216.92 34.29,214.63 34.29,212.09 31.75,209.55 18.54,209.55 v17.53,210.57 18.8,210.57 20.32,212.09 20.32,222.25 21.59,223.52 43.18,223.52 | 119.38,216.92 123.44,216.92 124.46,215.9 | 96.52,223.52 97.79,222.25 97.79,218.44 106.68,218.44 106.68,222.25 107.95,223.52 | 86.36,223.52 96.52,223.52 | 86.36,223.52 85.09,222.25 85.09,218.44 76.2,218.44 76.2,222.25 74.93,223.52 | 64.77,223.52 74.93,223.52 | 64.77,223.52 63.5,222.25 63.5,218.44 54.61,218.44 54.61,222.25 53.34,223.52 | 43.18,223.52 53.34,223.52 | 43.18,223.52 41.91,222.25 41.91,218.44 | 119.38,216.92 119.38,222.25 118.11,223.52 107.95,223.52 | 53.34,223.52 64.77,223.52 | 74.93,223.52 86.36,223.52 | 96.52,223.52 107.95,223.52
  pour Top (no thermals): 96.01,176.02 96.01,170.69 95.25,169.93 97.79,169.93 97.79,176.02
VSSA  (2 unrouted)
X_STOP  (13 unrouted)
Y_STOP  (2 unrouted)
Z_STOP  (2 unrouted)
(copper drawn outside any net)
  shapes: Top area x2